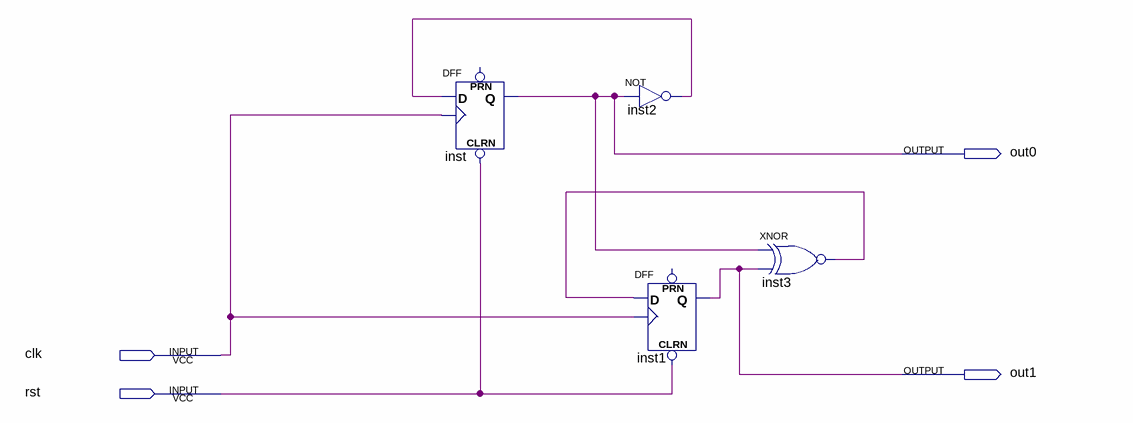
[diagram p0: schematic sheet]
// Quartus schematic twoBitSubstracter.bdf as structural Verilog: 4 symbols, 4 pins
module twoBitSubstracter (
  input  clk,
  input  rst,
  output out0,
  output out1
);

  wire inst2_out, inst3_out;

  DFF inst (.CLRN(rst), .CLK(clk), .D(inst2_out), .Q(out0));  // open: PRN
  not inst2 (inst2_out, out0);
  DFF inst1 (.CLRN(rst), .CLK(clk), .D(inst3_out), .Q(out1));  // open: PRN
  xnor inst3 (inst3_out, out0, out1);
endmodule
